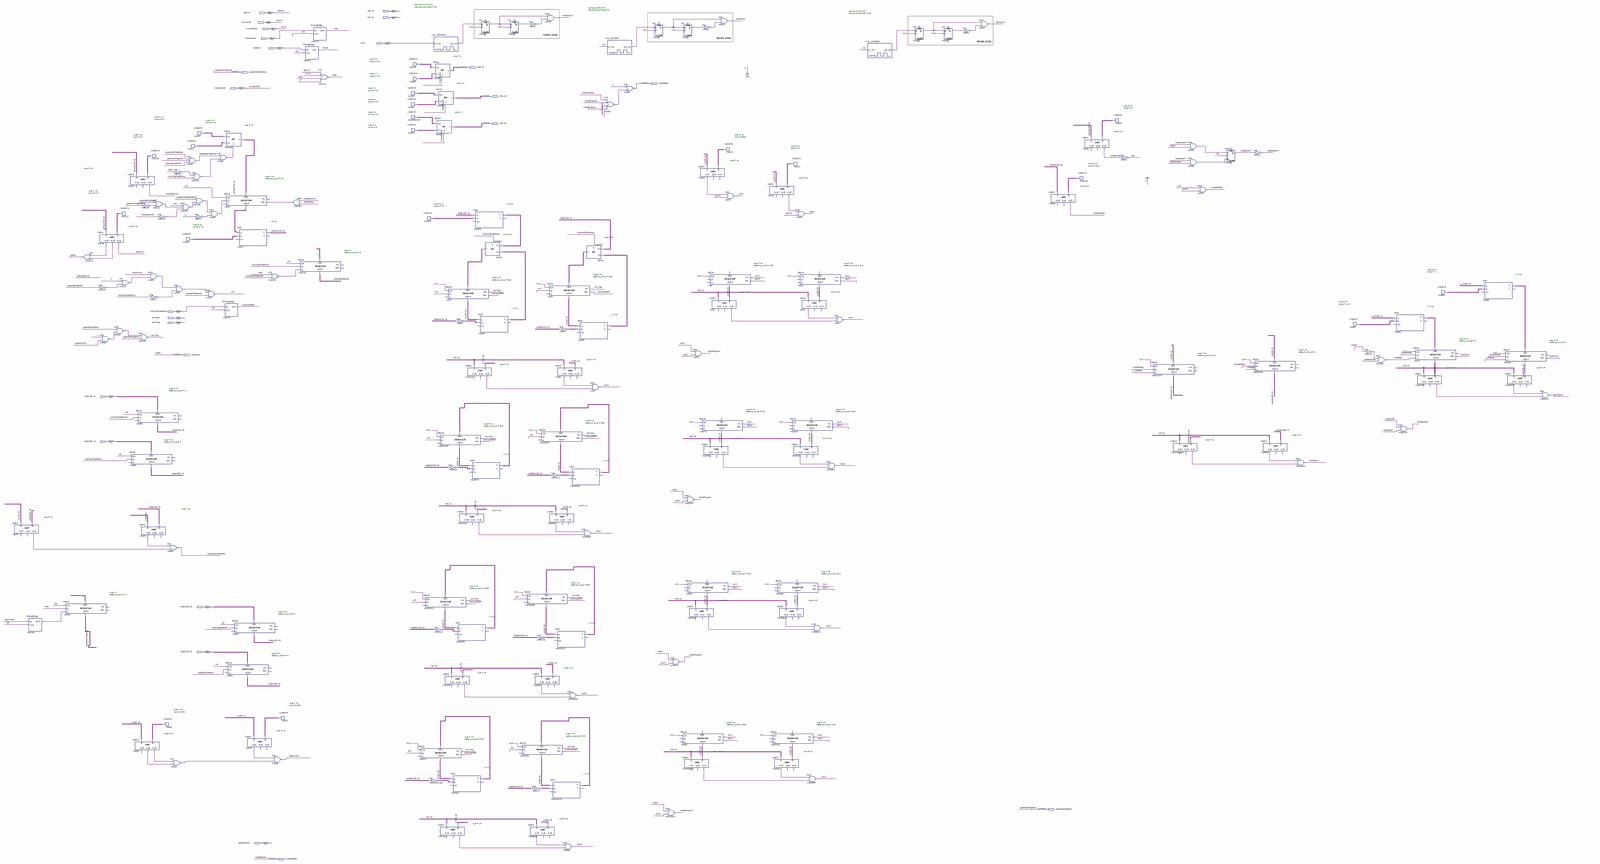
[diagram p0: schematic sheet, whole]
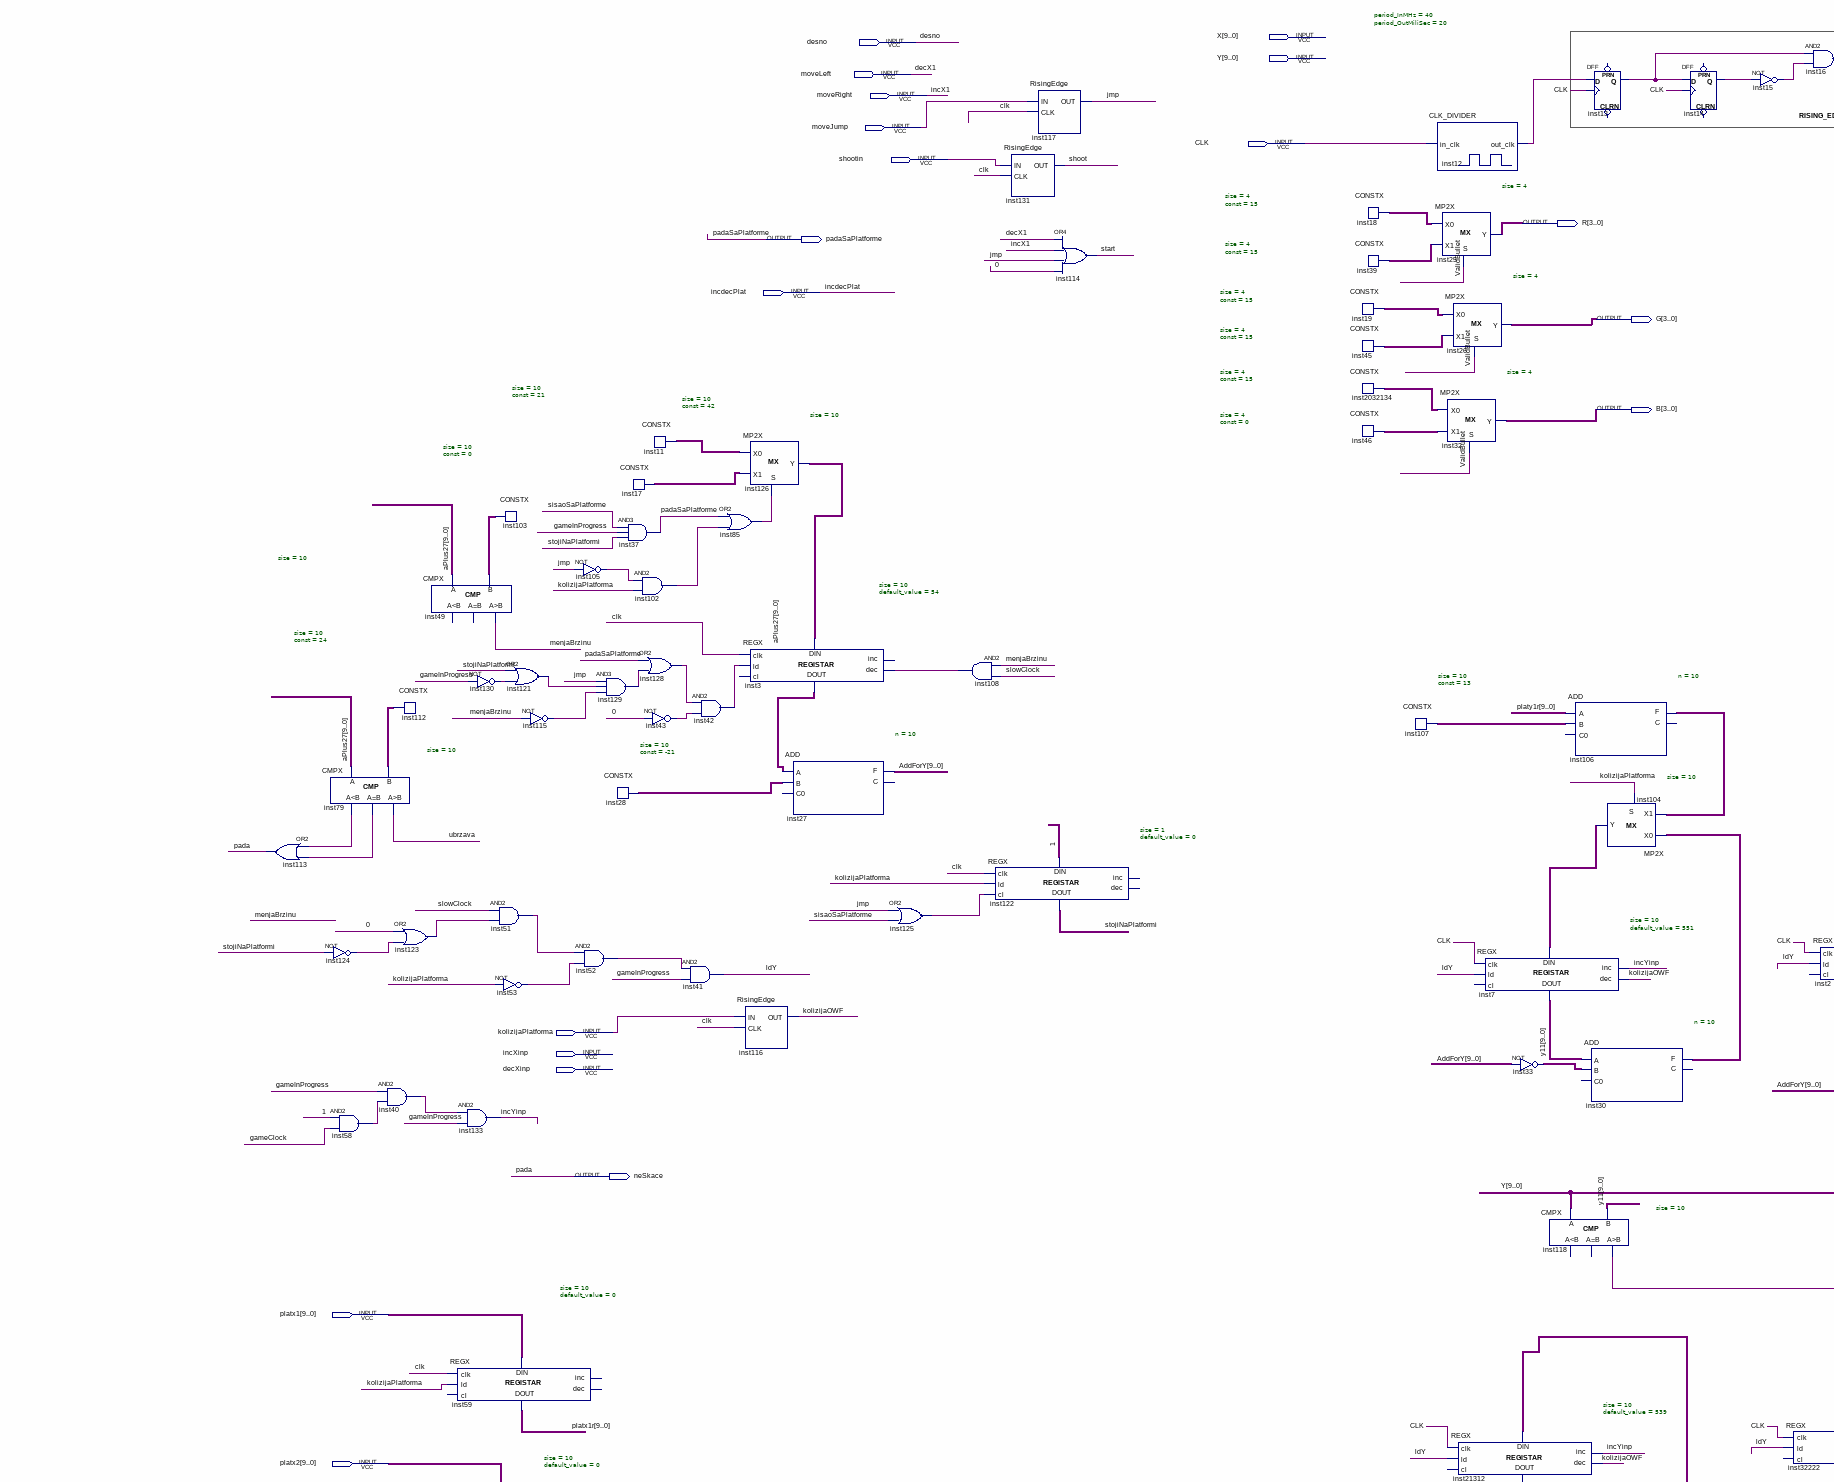
[diagram p1: schematic sheet, upper left part]
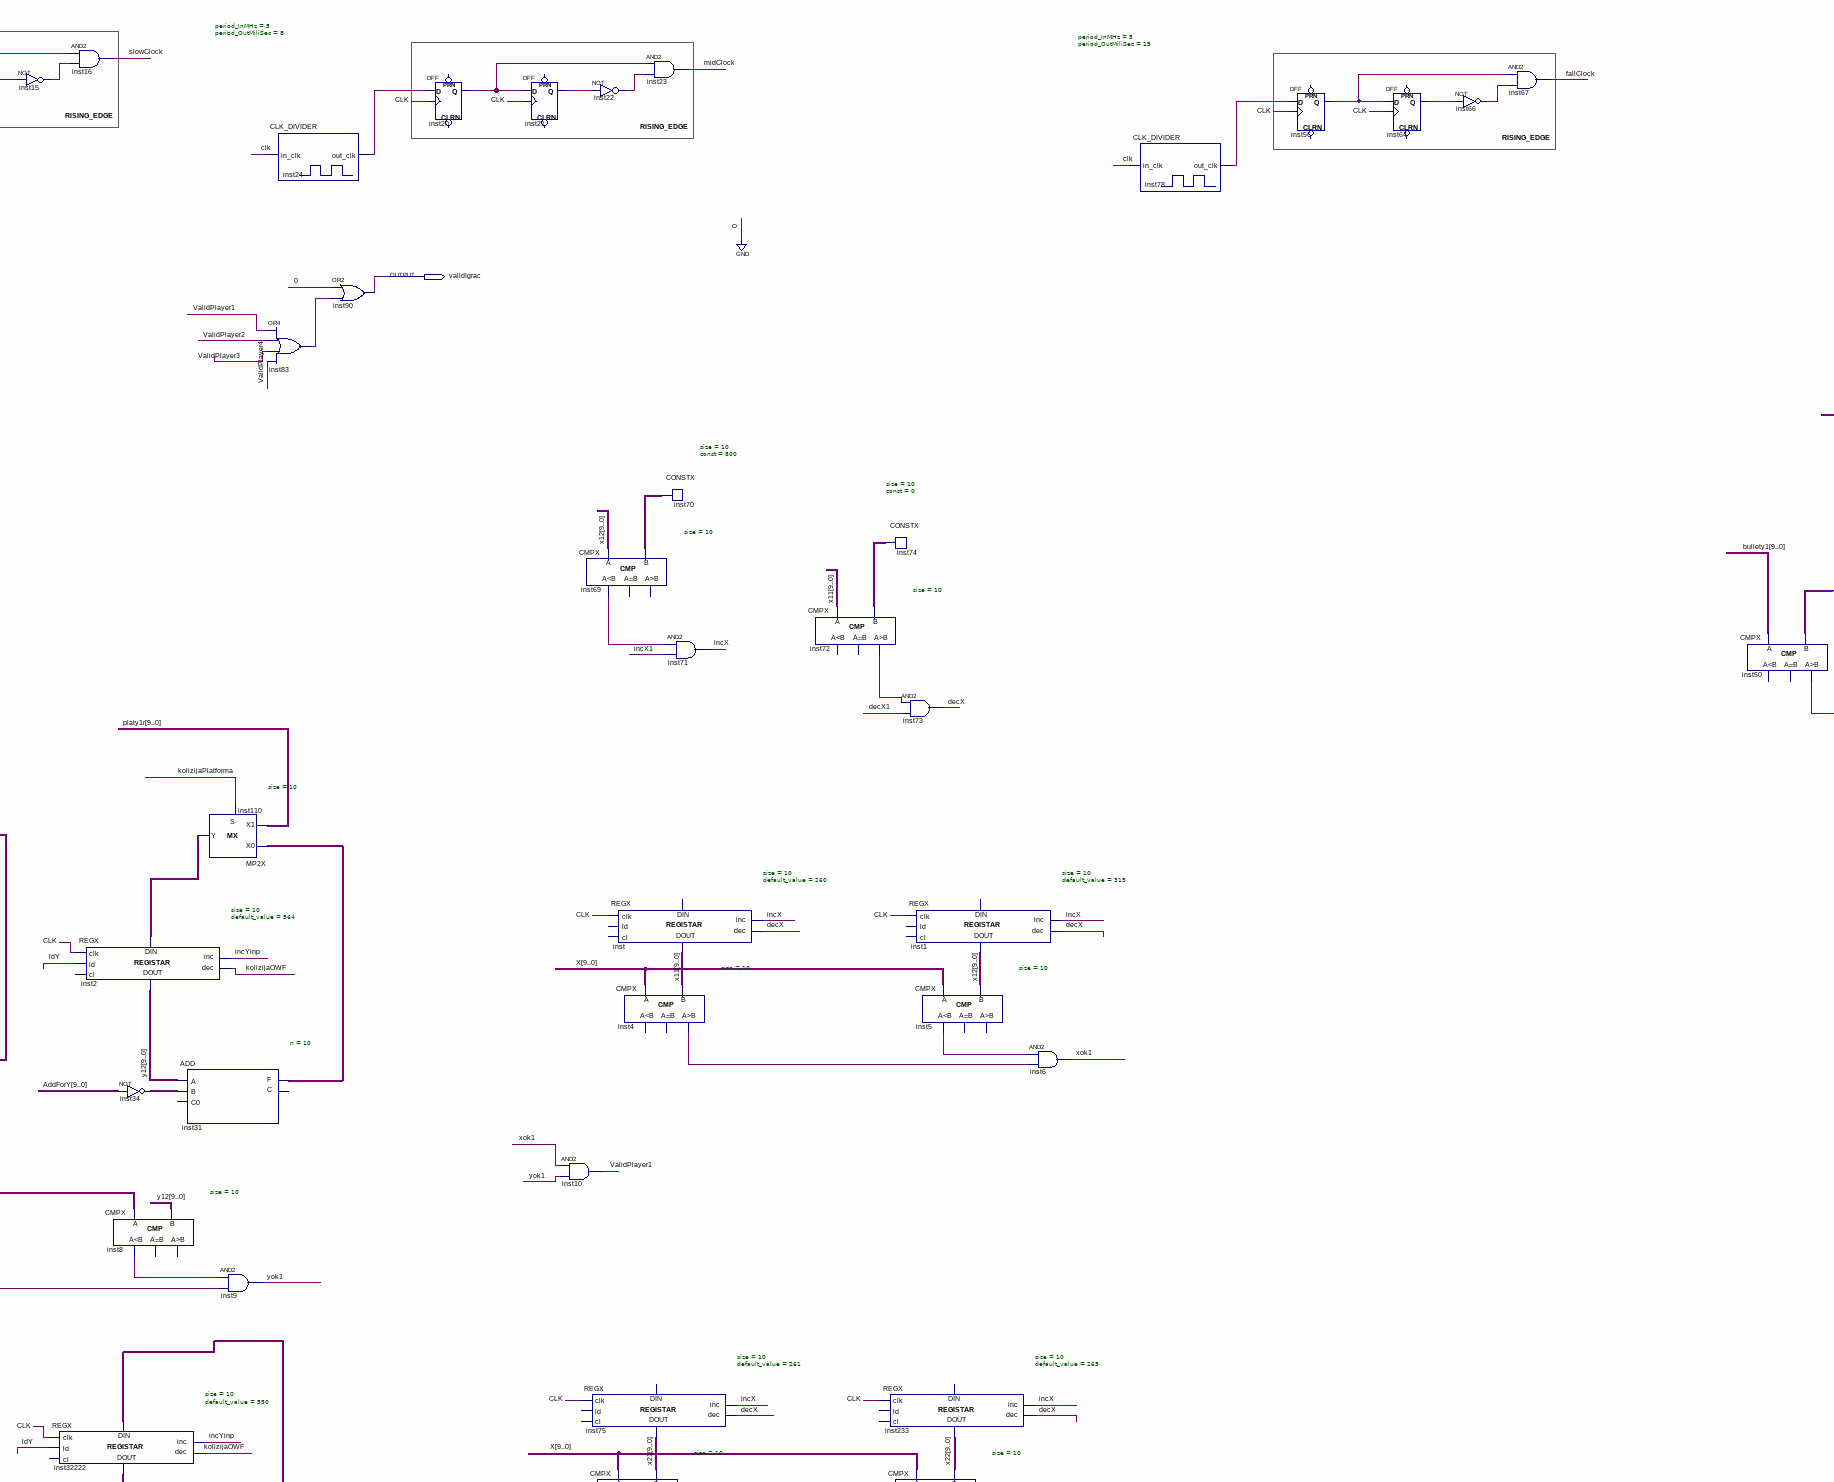
[diagram p2: schematic sheet, upper centre part]
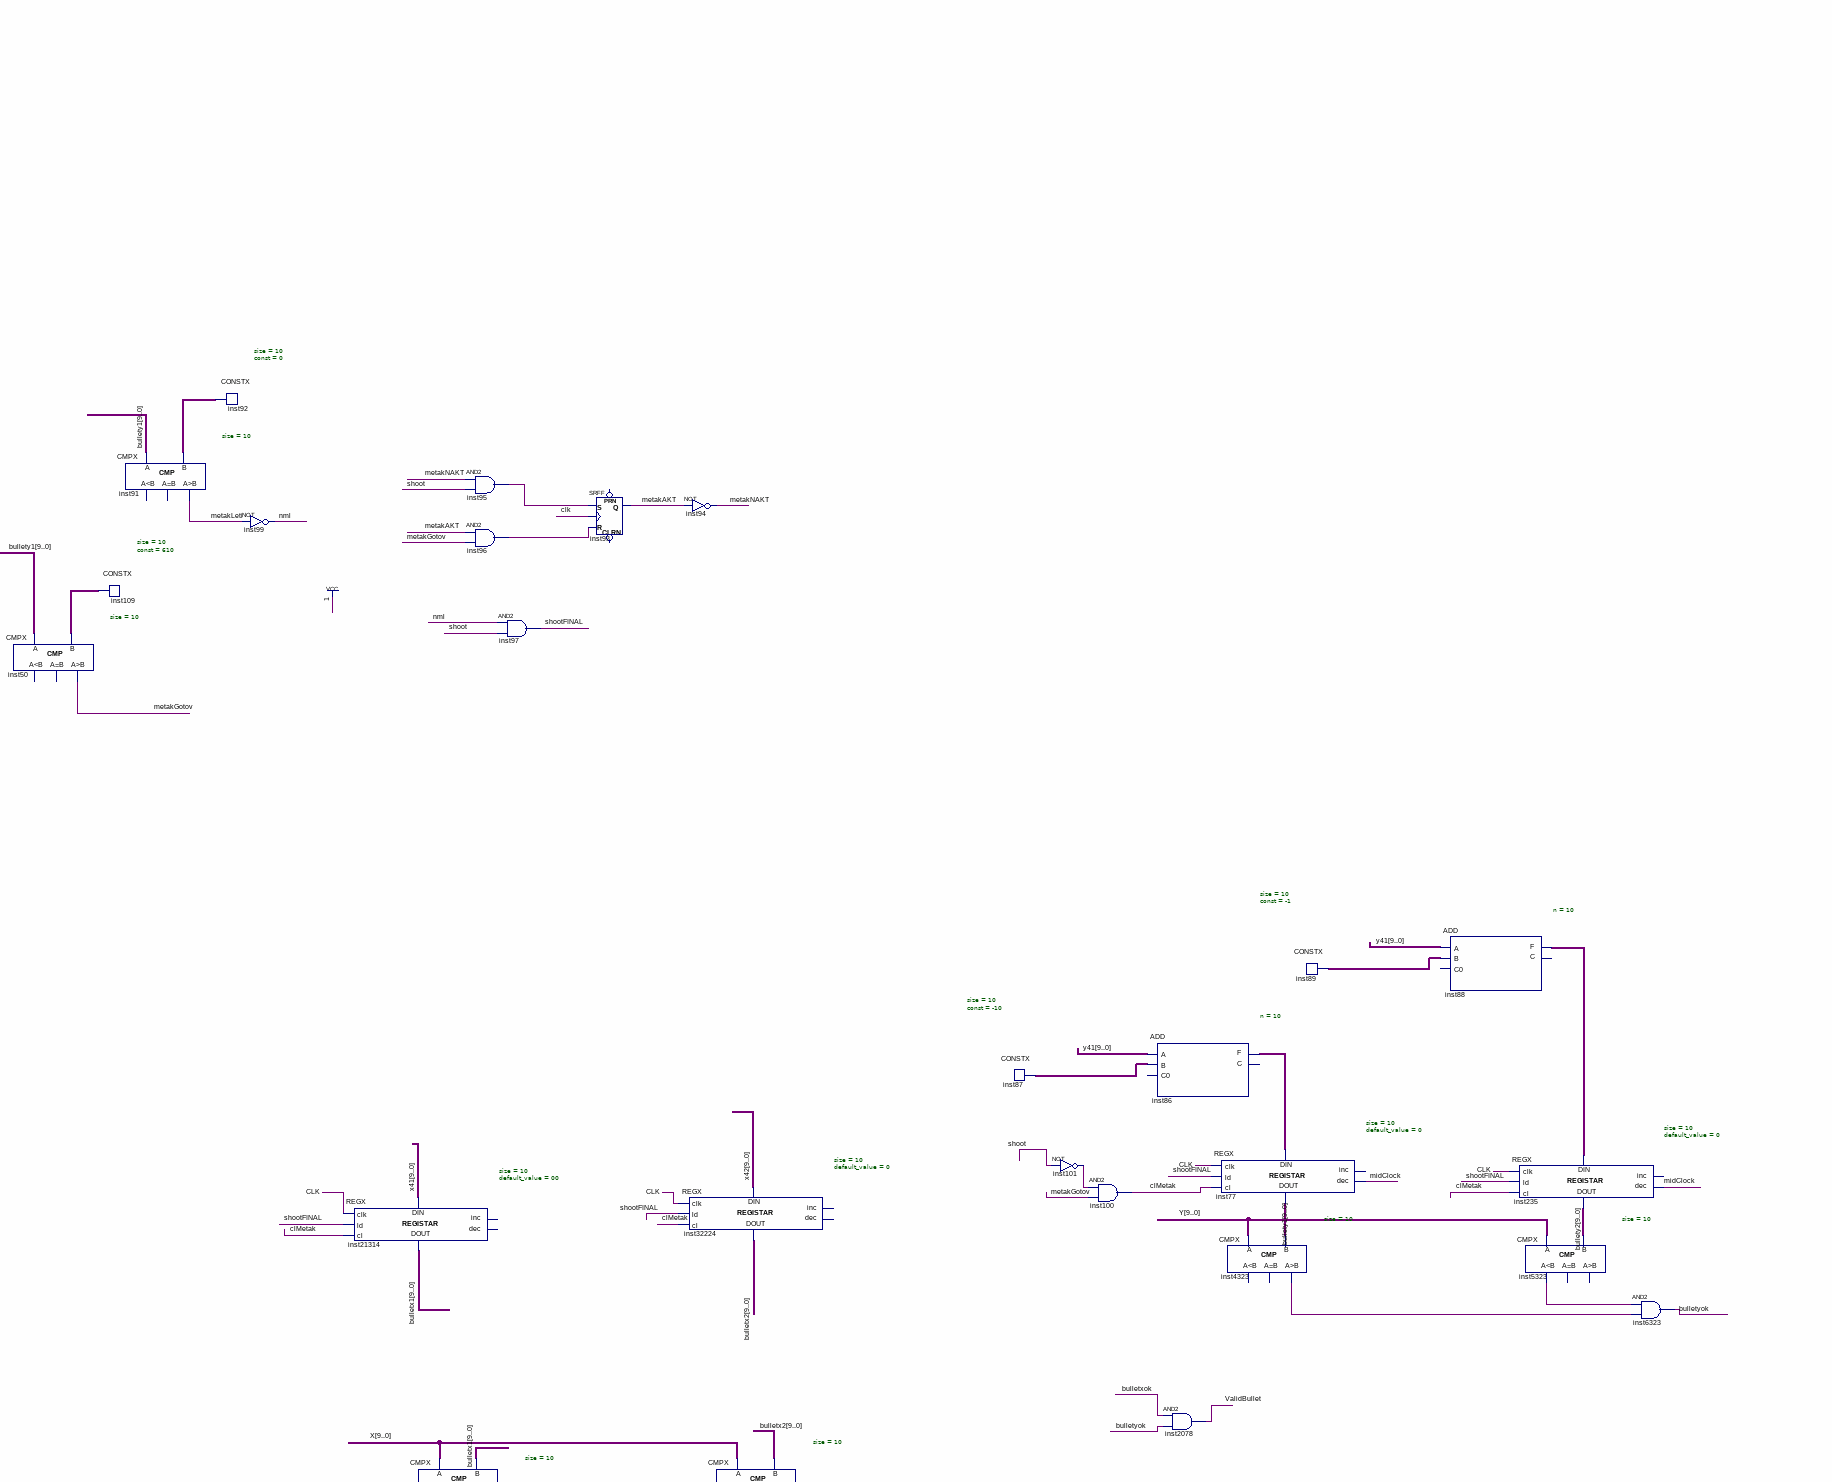
[diagram p3: schematic sheet, upper right part]
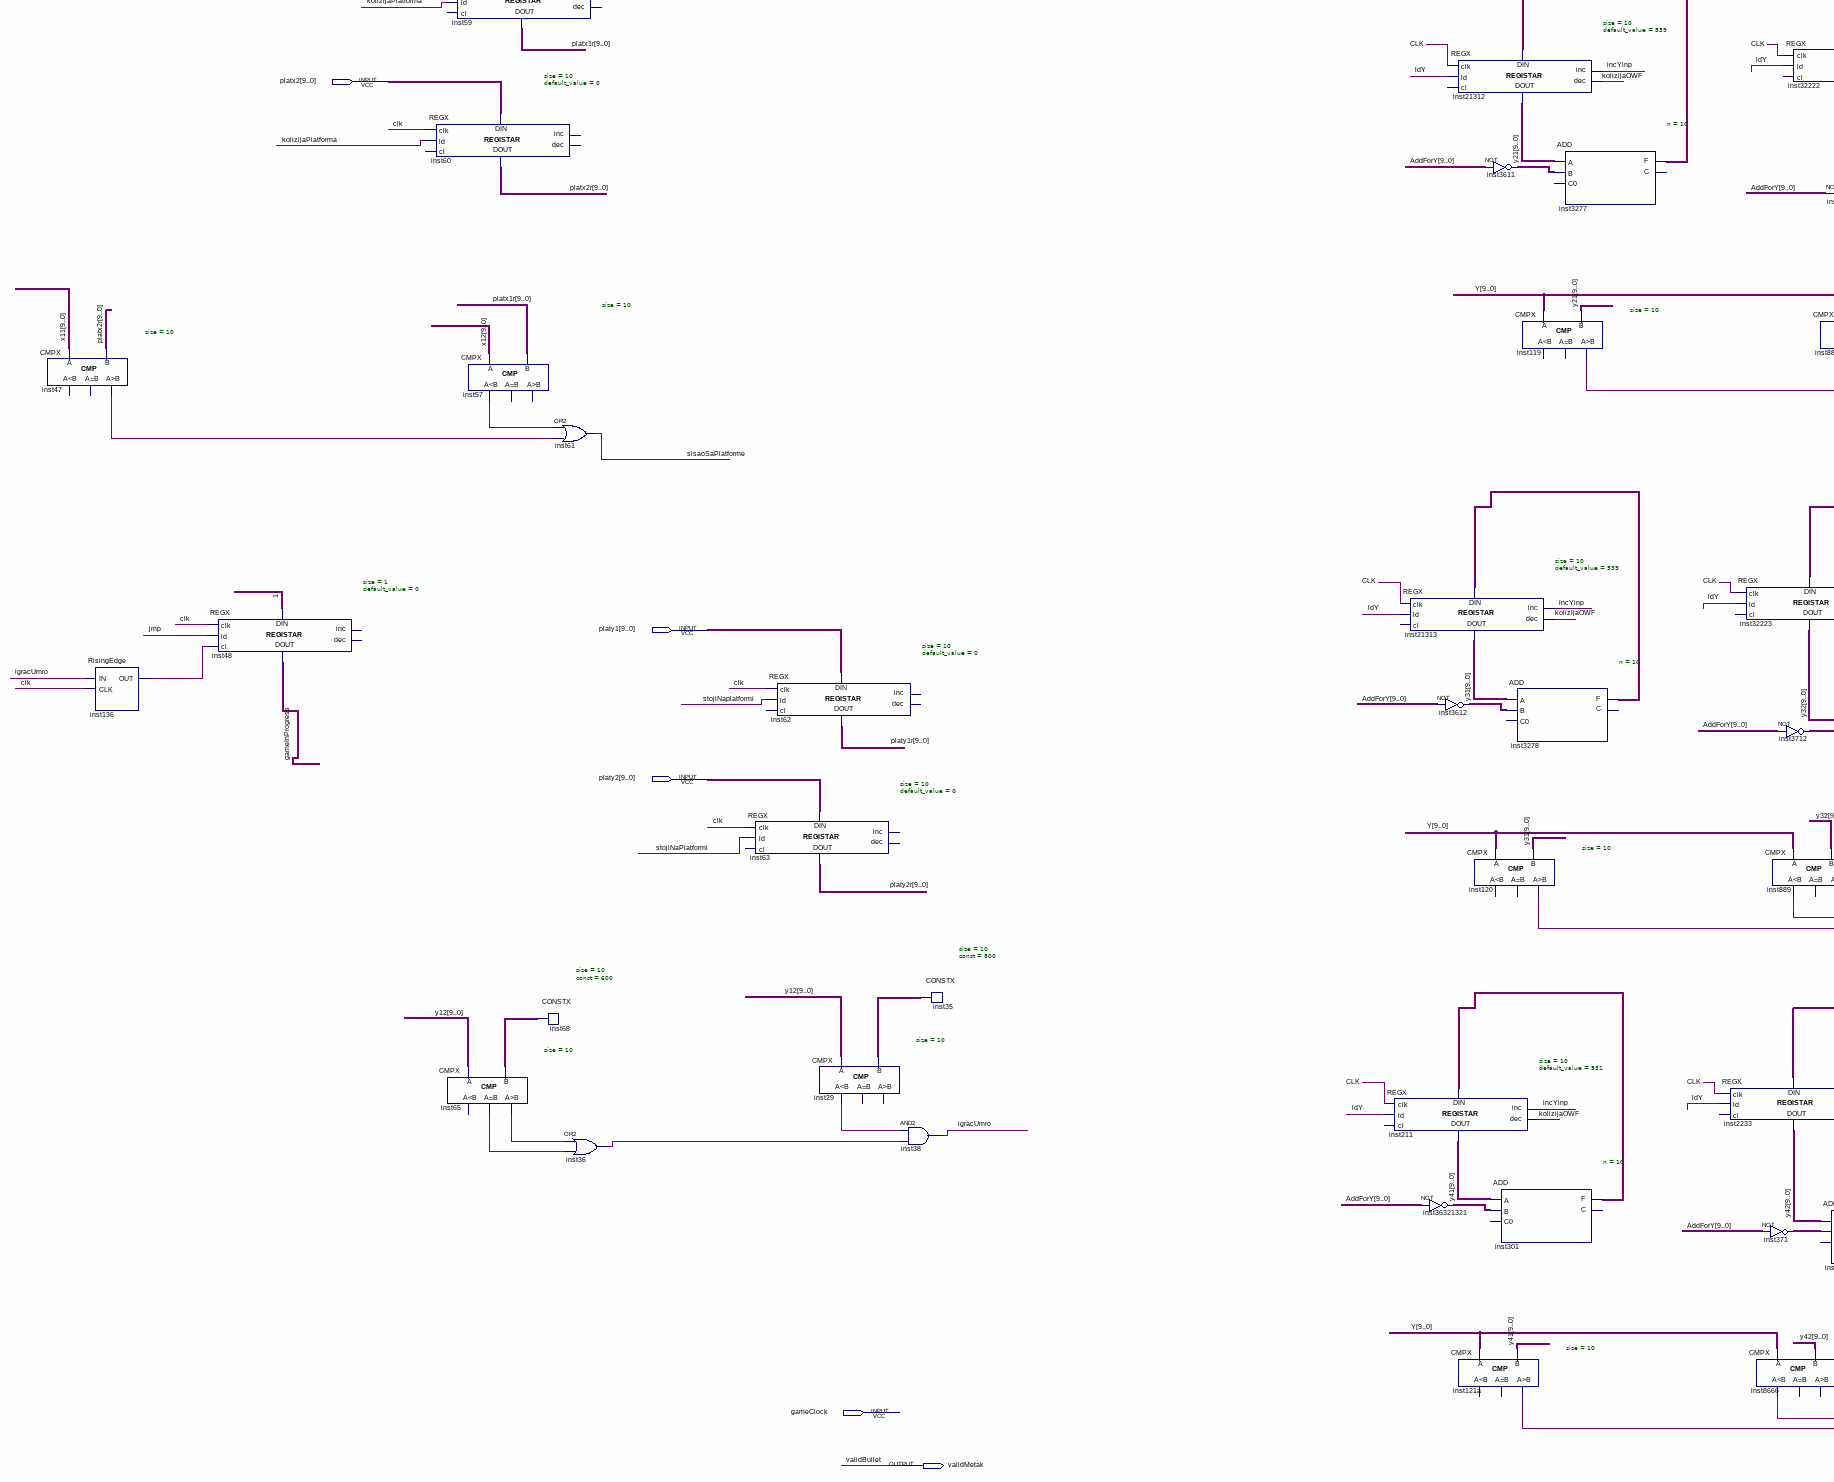
[diagram p4: schematic sheet, lower left part]
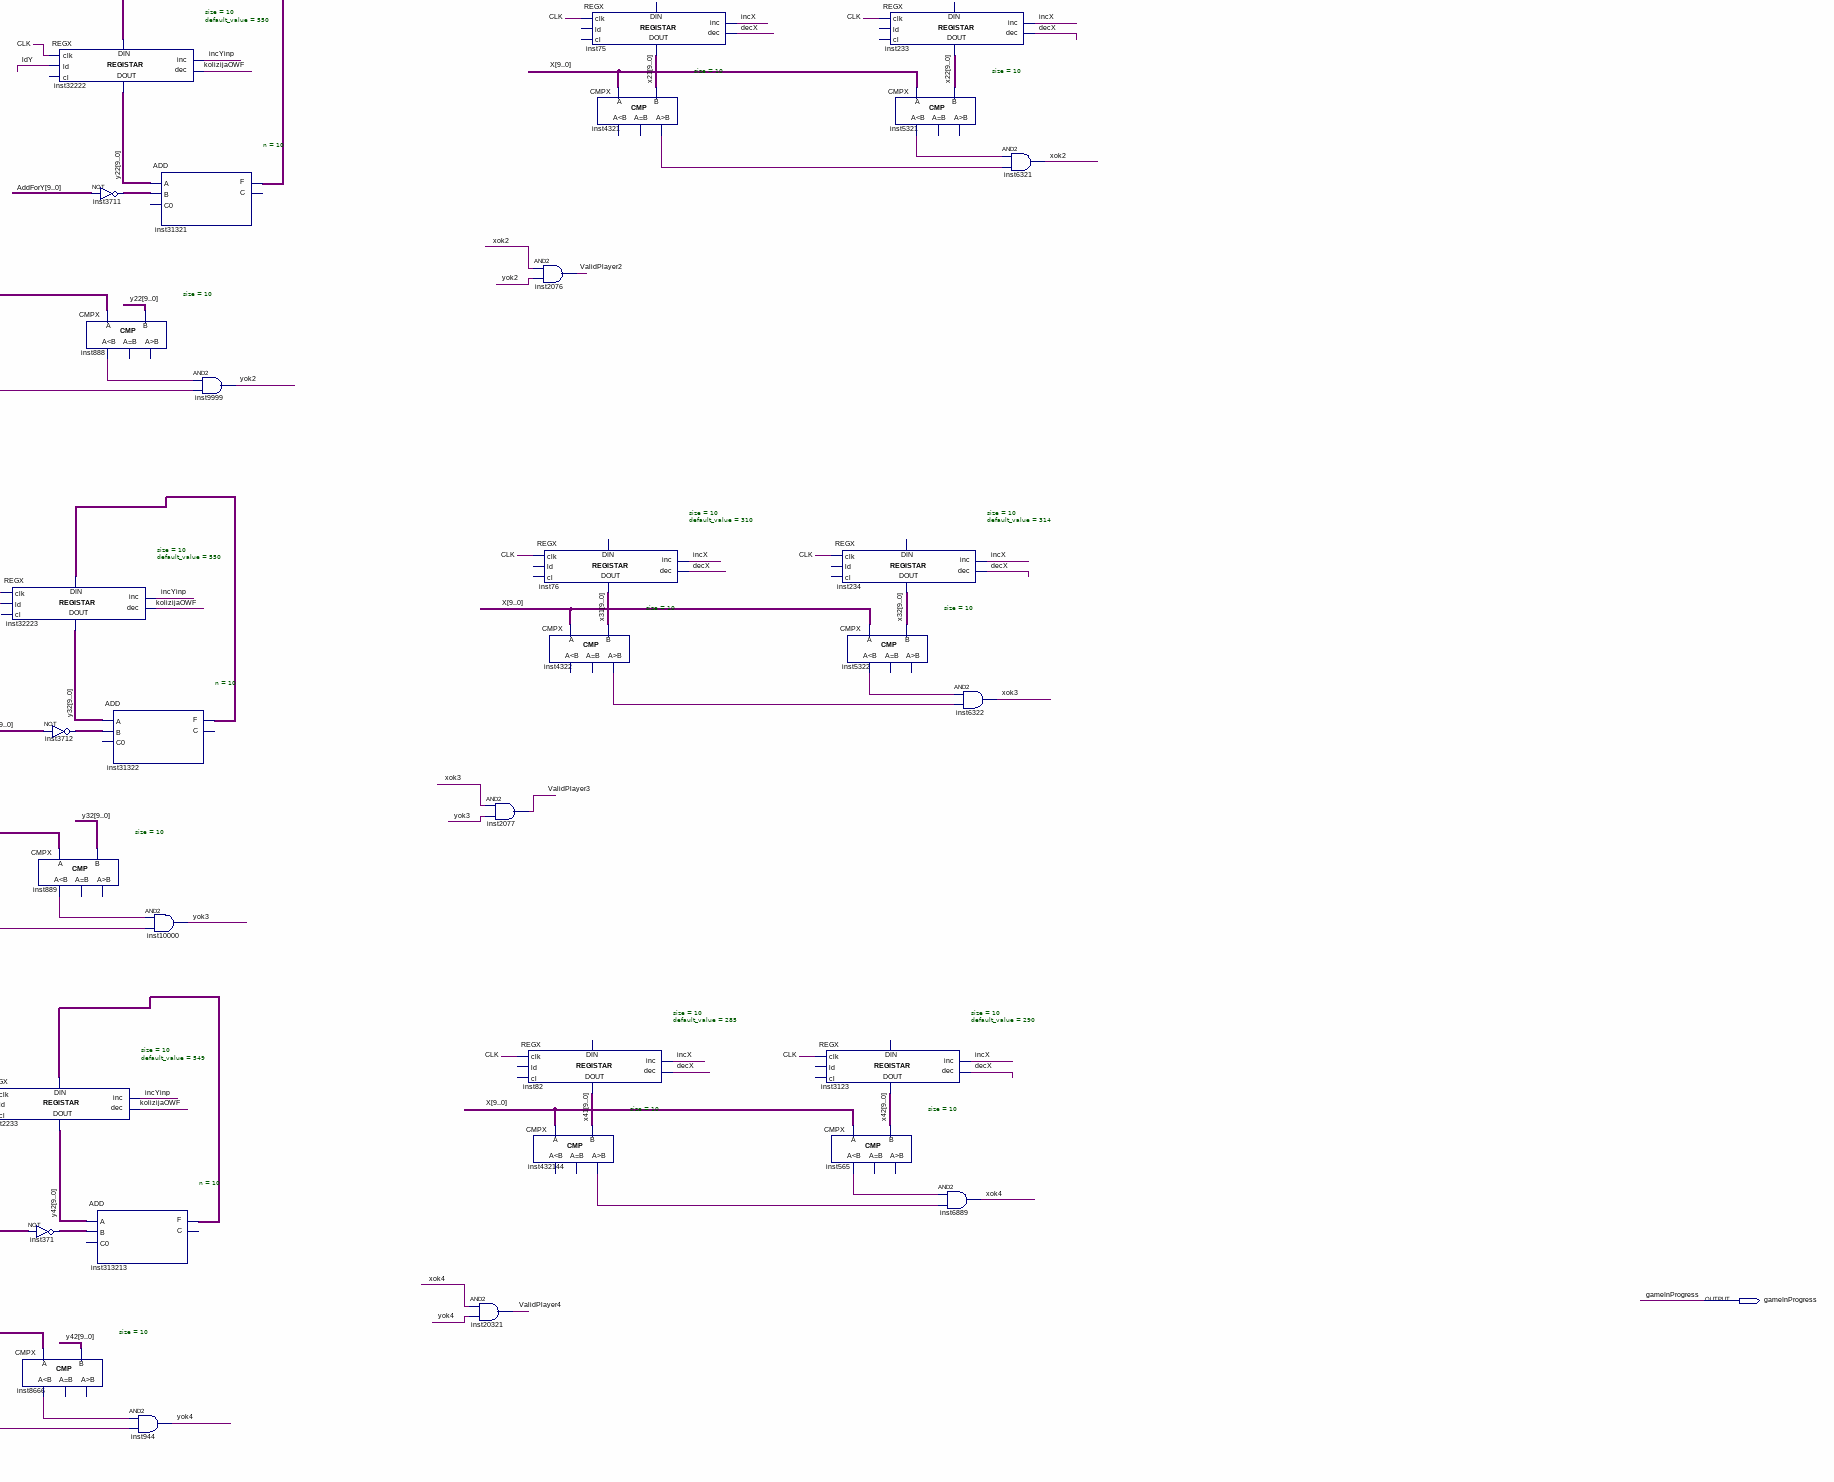
[diagram p5: schematic sheet, lower centre part]
// Quartus schematic LayerIgrac.bdf as structural Verilog: 176 symbols, 25 pins
module LayerIgrac (
  input  [9:0] X,
  input  desno,
  input  [9:0] Y,
  input  moveLeft,
  input  moveRight,
  input  moveJump,
  input  CLK,
  input  shootin,
  input  incdecPlat,
  input  kolizijaPlatforma,
  input  incXinp,
  input  decXinp,
  input  [9:0] platx1,
  input  [9:0] platx2,
  input  [9:0] platy1,
  input  [9:0] platy2,
  input  gameClock,
  output [3:0] R,
  output padaSaPlatforme,
  output validIgrac,
  output [3:0] G,
  output [3:0] B,
  output neSkace,
  output gameInProgress,
  output validMetak
);

  wire bulletxok, bulletyok, clMetak, decX, fallClock, igracUmro, incX, incYinp, inst4_gr, inst5_ls,
       inst8_ls, inst12_out_clk, inst13_q, inst14_q, inst15_out, inst20_q, inst21_q, inst22_out,
       inst24_out_clk, inst29_ls, inst36_out, inst40_out, inst42_out, inst43_out, inst47_gr, inst51_out,
       inst52_out, inst53_out, inst56_q, inst57_ls, inst58_out, inst64_q, inst65_eq, inst65_gr, inst66_out,
       inst69_ls, inst72_gr, inst78_out_clk, inst79_eq, inst79_ls, inst83_out, inst85_out, inst95_out,
       inst96_out, inst101_out, inst102_out, inst105_out, inst108_out, inst115_out, inst118_gr, inst119_gr,
       inst120_gr, inst121_out, inst121a_gr, inst122aasd_gr, inst123_out, inst124_out, inst125_out,
       inst128_out, inst129_out, inst130_out, inst136_out, inst565_ls, inst888_ls, inst889_ls, inst890_ls,
       inst4321_gr, inst4322_gr, inst4323_gr, inst5321_ls, inst5322_ls, inst5323_ls, inst8666_ls,
       inst432144_gr, jmp, kolizijaOWF, ldY, menjaBrzinu, metakAKT, metakGotov, metakLeti, metakNAKT,
       midClock, nml, shoot, shootFINAL, sisaoSaPlatforme, slowClock, start, stojiNaPlatformi, ubrzava,
       ValidPlayer1, ValidPlayer2, ValidPlayer3, ValidPlayer4, xok1, xok2, xok3, xok4, yok1, yok2, yok3, yok4;
  wire [3:0] inst18_data, inst19_data, inst39_data, inst45_data, inst46_data, inst2032134_data;
  wire [9:0] AddForY, aPlus27, bulletx1, bulletx2, bullety1, bullety2, inst11_data, inst17_data, inst28_data,
       inst30_f, inst31_f, inst33_out, inst34_out, inst35_data, inst68_data, inst70_data, inst74_data,
       inst86_f, inst87_data, inst88_f, inst89_data, inst92_data, inst103_data, inst104_y, inst106_f,
       inst107_data, inst109_data, inst110_y, inst112_data, inst126_y, inst301_f, inst371_out, inst3277_f,
       inst3278_f, inst3611_out, inst3612_out, inst3711_out, inst3712_out, inst31321_f, inst31322_f,
       inst313213_f, inst36321321_out, platx1r, platx2r, platy1r, platy2r, x11, x12, x21, x22, x31, x32, x41,
       x42, y11, y12, y21, y22, y31, y32, y41, y42;

  CMPX #(.size(10)) inst47 (.A(x11), .B(platx2r), .gr(inst47_gr));  // open: ls, eq
  RisingEdge inst136 (.IN(igracUmro), .CLK(CLK), .OUT(inst136_out));
  REGX #(.size(1), .default_value(0)) inst48 (
    .clk(CLK), .ld(jmp), .cl(inst136_out), .data_in(1'b1), .data_out(gameInProgress));  // open: inc, dec
  or inst113 (neSkace, inst79_ls, inst79_eq);
  CMPX #(.size(10)) inst79 (.A(aPlus27), .B(inst112_data), .ls(inst79_ls), .eq(inst79_eq), .gr(ubrzava));
  not inst124 (inst124_out, stojiNaPlatformi);
  and inst58 (inst58_out, 1'b1, gameClock);
  and inst40 (inst40_out, gameInProgress, inst58_out);
  CMPX #(.size(10)) inst49 (.A(aPlus27), .B(inst103_data), .gr(menjaBrzinu));  // open: ls, eq
  CONSTX #(.size(10), .\const (24)) inst112 (.data(inst112_data));
  or inst123 (inst123_out, 1'b0, inst124_out);
  REGX #(.size(10), .default_value(0)) inst60 (
    .clk(CLK), .ld(kolizijaPlatforma), .data_in(platx2), .data_out(platx2r));  // open: cl, inc, dec
  not inst130 (inst130_out, gameInProgress);
  and inst133 (incYinp, inst40_out, gameInProgress);
  REGX #(.size(10), .default_value(0)) inst59 (
    .clk(CLK), .ld(kolizijaPlatforma), .data_in(platx1), .data_out(platx1r));  // open: cl, inc, dec
  CMPX #(.size(10)) inst57 (.A(x12), .B(platx1r), .ls(inst57_ls));  // open: eq, gr
  CMPX #(.size(10)) inst65 (.A(y12), .B(inst68_data), .eq(inst65_eq), .gr(inst65_gr));  // open: ls
  CONSTX #(.size(10), .\const (0)) inst103 (.data(inst103_data));
  or inst121 (inst121_out, stojiNaPlatformi, inst130_out);
  and inst51 (inst51_out, slowClock, inst123_out);
  not inst53 (inst53_out, kolizijaPlatforma);
  not inst115 (inst115_out, menjaBrzinu);
  or inst61 (sisaoSaPlatforme, inst57_ls, inst47_gr);
  CONSTX #(.size(10), .\const (600)) inst68 (.data(inst68_data));
  not inst105 (inst105_out, jmp);
  and inst129 (inst129_out, jmp, inst121_out, inst115_out);
  CONSTX #(.size(10), .\const (-21)) inst28 (.data(inst28_data));
  and inst52 (inst52_out, inst51_out, inst53_out);
  or inst36 (inst36_out, inst65_gr, inst65_eq);
  CONSTX #(.size(10), .\const (42)) inst11 (.data(inst11_data));
  CONSTX #(.size(10), .\const (21)) inst17 (.data(inst17_data));
  and inst37 (padaSaPlatforme, sisaoSaPlatforme, gameInProgress, stojiNaPlatformi);
  and inst102 (inst102_out, inst105_out, kolizijaPlatforma);
  or inst128 (inst128_out, padaSaPlatforme, inst129_out);
  not inst43 (inst43_out, 1'b0);
  and inst41 (ldY, inst52_out, gameInProgress);
  or inst85 (inst85_out, padaSaPlatforme, inst102_out);
  and inst42 (inst42_out, inst128_out, inst43_out);
  MP2X #(.size(10)) inst126 (.S(inst85_out), .X0(inst11_data), .X1(inst17_data), .Y(inst126_y));
  REGX #(.size(10), .default_value(54)) inst3 (
    .clk(CLK), .ld(inst42_out), .dec(inst108_out), .data_in(inst126_y), .data_out(aPlus27));  // open: cl, inc
  RisingEdge inst116 (.IN(kolizijaPlatforma), .CLK(CLK), .OUT(kolizijaOWF));
  REGX #(.size(10), .default_value(0)) inst62 (
    .clk(CLK), .ld(stojiNaPlatformi), .data_in(platy1), .data_out(platy1r));  // open: cl, inc, dec
  REGX #(.size(10), .default_value(0)) inst63 (
    .clk(CLK), .ld(stojiNaPlatformi), .data_in(platy2), .data_out(platy2r));  // open: cl, inc, dec
  ADD #(.n(10)) inst27 (.A(aPlus27), .B(inst28_data), .F(AddForY));  // open: C0, C
  CMPX #(.size(10)) inst29 (.A(y12), .B(inst35_data), .ls(inst29_ls));  // open: eq, gr
  or inst125 (inst125_out, jmp, sisaoSaPlatforme);
  and inst38 (igracUmro, inst29_ls, inst36_out);
  CONSTX #(.size(10), .\const (800)) inst35 (.data(inst35_data));
  and inst108 (inst108_out, menjaBrzinu, slowClock);
  REGX #(.size(1), .default_value(0)) inst122 (
    .clk(CLK), .ld(kolizijaPlatforma), .cl(inst125_out), .data_in(1'b1), .data_out(stojiNaPlatformi));  // open: inc, dec
  RisingEdge inst117 (.IN(moveJump), .CLK(CLK), .OUT(jmp));
  RisingEdge inst131 (.IN(shootin), .CLK(CLK), .OUT(shoot));
  or inst114 (start, moveLeft, moveRight, jmp, 1'b0);
  CONSTX #(.size(4), .\const (15)) inst18 (.data(inst18_data));
  CONSTX #(.size(4), .\const (15)) inst39 (.data(inst39_data));
  CONSTX #(.size(4), .\const (15)) inst19 (.data(inst19_data));
  CONSTX #(.size(4), .\const (15)) inst45 (.data(inst45_data));
  CONSTX #(.size(4), .\const (15)) inst2032134 (.data(inst2032134_data));
  CONSTX #(.size(4), .\const (0)) inst46 (.data(inst46_data));
  CONSTX #(.size(10), .\const (13)) inst107 (.data(inst107_data));
  REGX #(.size(10), .default_value(539)) inst21313 (
    .clk(CLK), .ld(ldY), .inc(incYinp), .dec(kolizijaOWF), .data_in(inst3278_f), .data_out(y31));  // open: cl
  REGX #(.size(10), .default_value(531)) inst211 (
    .clk(CLK), .ld(ldY), .inc(incYinp), .dec(kolizijaOWF), .data_in(inst301_f), .data_out(y41));  // open: cl
  CLK_DIVIDER #(.period_InMHz(40), .period_OutMiliSec(20)) inst12 (.in_clk(CLK), .out_clk(inst12_out_clk));
  MP2X #(.size(4)) inst25 (.S(validMetak), .X0(inst18_data), .X1(inst39_data), .Y(R));
  MP2X #(.size(4)) inst26 (.S(validMetak), .X0(inst19_data), .X1(inst45_data), .Y(G));
  MP2X #(.size(4)) inst32 (.S(validMetak), .X0(inst2032134_data), .X1(inst46_data), .Y(B));
  REGX #(.size(10), .default_value(539)) inst21312 (
    .clk(CLK), .ld(ldY), .inc(incYinp), .dec(kolizijaOWF), .data_in(inst3277_f), .data_out(y21));  // open: cl
  assign inst3612_out = ~AddForY;  // NOT inst3612, 10 bits wide
  assign inst36321321_out = ~AddForY;  // NOT inst36321321, 10 bits wide
  CMPX #(.size(10)) inst121a (.A(Y), .B(y41), .gr(inst121a_gr));  // open: ls, eq
  REGX #(.size(10), .default_value(551)) inst7 (
    .clk(CLK), .ld(ldY), .inc(incYinp), .dec(kolizijaOWF), .data_in(inst104_y), .data_out(y11));  // open: cl
  assign inst3611_out = ~AddForY;  // NOT inst3611, 10 bits wide
  CMPX #(.size(10)) inst120 (.A(Y), .B(y31), .gr(inst120_gr));  // open: ls, eq
  ADD #(.n(10)) inst301 (.A(y41), .B(inst36321321_out), .F(inst301_f));  // open: C0, C
  assign inst33_out = ~AddForY;  // NOT inst33, 10 bits wide
  CMPX #(.size(10)) inst118 (.A(Y), .B(y11), .gr(inst118_gr));  // open: ls, eq
  CMPX #(.size(10)) inst119 (.A(Y), .B(y21), .gr(inst119_gr));  // open: ls, eq
  ADD #(.n(10)) inst3278 (.A(y31), .B(inst3612_out), .F(inst3278_f));  // open: C0, C
  ADD #(.n(10)) inst106 (.A(platy1r), .B(inst107_data), .F(inst106_f));  // open: C0, C
  ADD #(.n(10)) inst30 (.A(y11), .B(inst33_out), .F(inst30_f));  // open: C0, C
  ADD #(.n(10)) inst3277 (.A(y21), .B(inst3611_out), .F(inst3277_f));  // open: C0, C
  DFF inst13 (.CLK(CLK), .D(inst12_out_clk), .Q(inst13_q));  // open: CLRN, PRN
  MP2X #(.size(10)) inst104 (.S(kolizijaPlatforma), .X0(inst30_f), .X1(inst106_f), .Y(inst104_y));
  DFF inst14 (.CLK(CLK), .D(inst13_q), .Q(inst14_q));  // open: CLRN, PRN
  not inst15 (inst15_out, inst14_q);
  REGX #(.size(10), .default_value(550)) inst32223 (
    .clk(CLK), .ld(ldY), .inc(incYinp), .dec(kolizijaOWF), .data_in(inst31322_f), .data_out(y32));  // open: cl
  REGX #(.size(10), .default_value(549)) inst2233 (
    .clk(CLK), .ld(ldY), .inc(incYinp), .dec(kolizijaOWF), .data_in(inst313213_f), .data_out(y42));  // open: cl
  CMPX #(.size(10)) inst8666 (.A(Y), .B(y42), .ls(inst8666_ls));  // open: eq, gr
  REGX #(.size(10), .default_value(550)) inst32222 (
    .clk(CLK), .ld(ldY), .inc(incYinp), .dec(kolizijaOWF), .data_in(inst31321_f), .data_out(y22));  // open: cl
  assign inst3712_out = ~AddForY;  // NOT inst3712, 10 bits wide
  CMPX #(.size(10)) inst889 (.A(Y), .B(y32), .ls(inst889_ls));  // open: eq, gr
  assign inst371_out = ~AddForY;  // NOT inst371, 10 bits wide
  and inst16 (slowClock, inst13_q, inst15_out);
  REGX #(.size(10), .default_value(564)) inst2 (
    .clk(CLK), .ld(ldY), .inc(incYinp), .dec(kolizijaOWF), .data_in(inst110_y), .data_out(y12));  // open: cl
  CMPX #(.size(10)) inst8 (.A(Y), .B(y12), .ls(inst8_ls));  // open: eq, gr
  assign inst3711_out = ~AddForY;  // NOT inst3711, 10 bits wide
  CMPX #(.size(10)) inst888 (.A(Y), .B(y22), .ls(inst888_ls));  // open: eq, gr
  ADD #(.n(10)) inst31322 (.A(y32), .B(inst3712_out), .F(inst31322_f));  // open: C0, C
  ADD #(.n(10)) inst313213 (.A(y42), .B(inst371_out), .F(inst313213_f));  // open: C0, C
  assign inst34_out = ~AddForY;  // NOT inst34, 10 bits wide
  and inst10000 (yok3, inst889_ls, inst120_gr);
  and inst944 (yok4, inst8666_ls, inst121a_gr);
  ADD #(.n(10)) inst31 (.A(y12), .B(inst34_out), .F(inst31_f));  // open: C0, C
  ADD #(.n(10)) inst31321 (.A(y22), .B(inst3711_out), .F(inst31321_f));  // open: C0, C
  MP2X #(.size(10)) inst110 (.S(kolizijaPlatforma), .X0(inst31_f), .X1(platy1r), .Y(inst110_y));
  and inst9 (yok1, inst8_ls, inst118_gr);
  and inst9999 (yok2, inst888_ls, inst119_gr);
  CLK_DIVIDER #(.period_InMHz(5), .period_OutMiliSec(8)) inst24 (.in_clk(CLK), .out_clk(inst24_out_clk));
  or inst83 (inst83_out, ValidPlayer1, ValidPlayer2, ValidPlayer3, ValidPlayer4);
  or inst90 (validIgrac, 1'b0, inst83_out);
  DFF inst20 (.CLK(CLK), .D(inst24_out_clk), .Q(inst20_q));  // open: CLRN, PRN
  and inst2077 (ValidPlayer3, xok3, yok3);
  and inst20321 (ValidPlayer4, xok4, yok4);
  DFF inst21 (.CLK(CLK), .D(inst20_q), .Q(inst21_q));  // open: CLRN, PRN
  REGX #(.size(10), .default_value(285)) inst82 (
    .clk(CLK), .inc(incX), .dec(decX), .data_out(x41));  // open: ld, cl, data_in
  CMPX #(.size(10)) inst432144 (.A(X), .B(x41), .gr(inst432144_gr));  // open: ls, eq
  and inst10 (ValidPlayer1, xok1, yok1);
  and inst2076 (ValidPlayer2, xok2, yok2);
  REGX #(.size(10), .default_value(310)) inst76 (
    .clk(CLK), .inc(incX), .dec(decX), .data_out(x31));  // open: ld, cl, data_in
  CMPX #(.size(10)) inst4322 (.A(X), .B(x31), .gr(inst4322_gr));  // open: ls, eq
  not inst22 (inst22_out, inst21_q);
  CMPX #(.size(10)) inst69 (.A(x12), .B(inst70_data), .ls(inst69_ls));  // open: eq, gr
  REGX #(.size(10), .default_value(260)) inst (
    .clk(CLK), .inc(incX), .dec(decX), .data_out(x11));  // open: ld, cl, data_in
  CMPX #(.size(10)) inst4 (.A(X), .B(x11), .gr(inst4_gr));  // open: ls, eq
  REGX #(.size(10), .default_value(261)) inst75 (
    .clk(CLK), .inc(incX), .dec(decX), .data_out(x21));  // open: ld, cl, data_in
  CMPX #(.size(10)) inst4321 (.A(X), .B(x21), .gr(inst4321_gr));  // open: ls, eq
  and inst23 (midClock, inst20_q, inst22_out);
  CONSTX #(.size(10), .\const (800)) inst70 (.data(inst70_data));
  and inst71 (incX, inst69_ls, moveRight);
  CMPX #(.size(10)) inst72 (.A(x11), .B(inst74_data), .gr(inst72_gr));  // open: ls, eq
  REGX #(.size(10), .default_value(290)) inst3123 (
    .clk(CLK), .inc(incX), .dec(decX), .data_out(x42));  // open: ld, cl, data_in
  CMPX #(.size(10)) inst565 (.A(X), .B(x42), .ls(inst565_ls));  // open: eq, gr
  REGX #(.size(10), .default_value(314)) inst234 (
    .clk(CLK), .inc(incX), .dec(decX), .data_out(x32));  // open: ld, cl, data_in
  CMPX #(.size(10)) inst5322 (.A(X), .B(x32), .ls(inst5322_ls));  // open: eq, gr
  CONSTX #(.size(10), .\const (0)) inst74 (.data(inst74_data));
  and inst73 (decX, inst72_gr, moveLeft);
  REGX #(.size(10), .default_value(315)) inst1 (
    .clk(CLK), .inc(incX), .dec(decX), .data_out(x12));  // open: ld, cl, data_in
  CMPX #(.size(10)) inst5 (.A(X), .B(x12), .ls(inst5_ls));  // open: eq, gr
  REGX #(.size(10), .default_value(265)) inst233 (
    .clk(CLK), .inc(incX), .dec(decX), .data_out(x22));  // open: ld, cl, data_in
  CMPX #(.size(10)) inst5321 (.A(X), .B(x22), .ls(inst5321_ls));  // open: eq, gr
  and inst6322 (xok3, inst5322_ls, inst4322_gr);
  and inst6889 (xok4, inst565_ls, inst432144_gr);
  and inst6 (xok1, inst5_ls, inst4_gr);
  and inst6321 (xok2, inst5321_ls, inst4321_gr);
  CLK_DIVIDER #(.period_InMHz(5), .period_OutMiliSec(15)) inst78 (.in_clk(CLK), .out_clk(inst78_out_clk));
  DFF inst56 (.CLK(CLK), .D(inst78_out_clk), .Q(inst56_q));  // open: CLRN, PRN
  DFF inst64 (.CLK(CLK), .D(inst56_q), .Q(inst64_q));  // open: CLRN, PRN
  not inst66 (inst66_out, inst64_q);
  and inst67 (fallClock, inst56_q, inst66_out);
  CMPX #(.size(10)) inst50 (.A(bullety1), .B(inst109_data), .gr(metakGotov));  // open: ls, eq
  CMPX #(.size(10)) inst91 (.A(bullety1), .B(inst92_data), .gr(metakLeti));  // open: ls, eq
  CONSTX #(.size(10), .\const (610)) inst109 (.data(inst109_data));
  CONSTX #(.size(10), .\const (0)) inst92 (.data(inst92_data));
  not inst99 (nml, metakLeti);
  REGX #(.size(10), .default_value(00)) inst21314 (
    .clk(CLK), .ld(shootFINAL), .cl(clMetak), .data_in(x41), .data_out(bulletx1));  // open: inc, dec
  CMPX #(.size(10)) inst122aasd (.A(X), .B(bulletx1), .gr(inst122aasd_gr));  // open: ls, eq
  and inst95 (inst95_out, metakNAKT, shoot);
  and inst96 (inst96_out, metakAKT, metakGotov);
  and inst97 (shootFINAL, nml, shoot);
  SRFF inst93 (.S(inst95_out), .R(inst96_out), .CLK(CLK), .Q(metakAKT));  // open: PRN, CLRN
  not inst94 (metakNAKT, metakAKT);
  REGX #(.size(10), .default_value(0)) inst32224 (
    .clk(CLK), .ld(shootFINAL), .cl(clMetak), .data_in(x42), .data_out(bulletx2));  // open: inc, dec
  CMPX #(.size(10)) inst890 (.A(X), .B(bulletx2), .ls(inst890_ls));  // open: eq, gr
  and inst10001 (bulletxok, inst890_ls, inst122aasd_gr);
  CONSTX #(.size(10), .\const (-10)) inst87 (.data(inst87_data));
  not inst101 (inst101_out, shoot);
  and inst100 (clMetak, inst101_out, metakGotov);
  ADD #(.n(10)) inst86 (.A(y41), .B(inst87_data), .F(inst86_f));  // open: C0, C
  and inst2078 (validMetak, bulletxok, bulletyok);
  REGX #(.size(10), .default_value(0)) inst77 (
    .clk(CLK), .ld(shootFINAL), .cl(clMetak), .dec(midClock), .data_in(inst86_f), .data_out(bullety1));  // open: inc
  CMPX #(.size(10)) inst4323 (.A(Y), .B(bullety1), .gr(inst4323_gr));  // open: ls, eq
  CONSTX #(.size(10), .\const (-1)) inst89 (.data(inst89_data));
  ADD #(.n(10)) inst88 (.A(y41), .B(inst89_data), .F(inst88_f));  // open: C0, C
  REGX #(.size(10), .default_value(0)) inst235 (
    .clk(CLK), .ld(shootFINAL), .cl(clMetak), .dec(midClock), .data_in(inst88_f), .data_out(bullety2));  // open: inc
  CMPX #(.size(10)) inst5323 (.A(Y), .B(bullety2), .ls(inst5323_ls));  // open: eq, gr
  and inst6323 (bulletyok, inst5323_ls, inst4323_gr);

  // Other names for the same wires on the sheet: decX1 = moveLeft; incX1 = moveRight; pada = neSkace;
  //   ValidBullet = validMetak

  // Notes on the sheet:
  //   RISING_EDGE
  //   RISING_EDGE
  //   RISING_EDGE
endmodule
